# EAGLE design Red Build Button v1.1 (EAGLE 6.1)
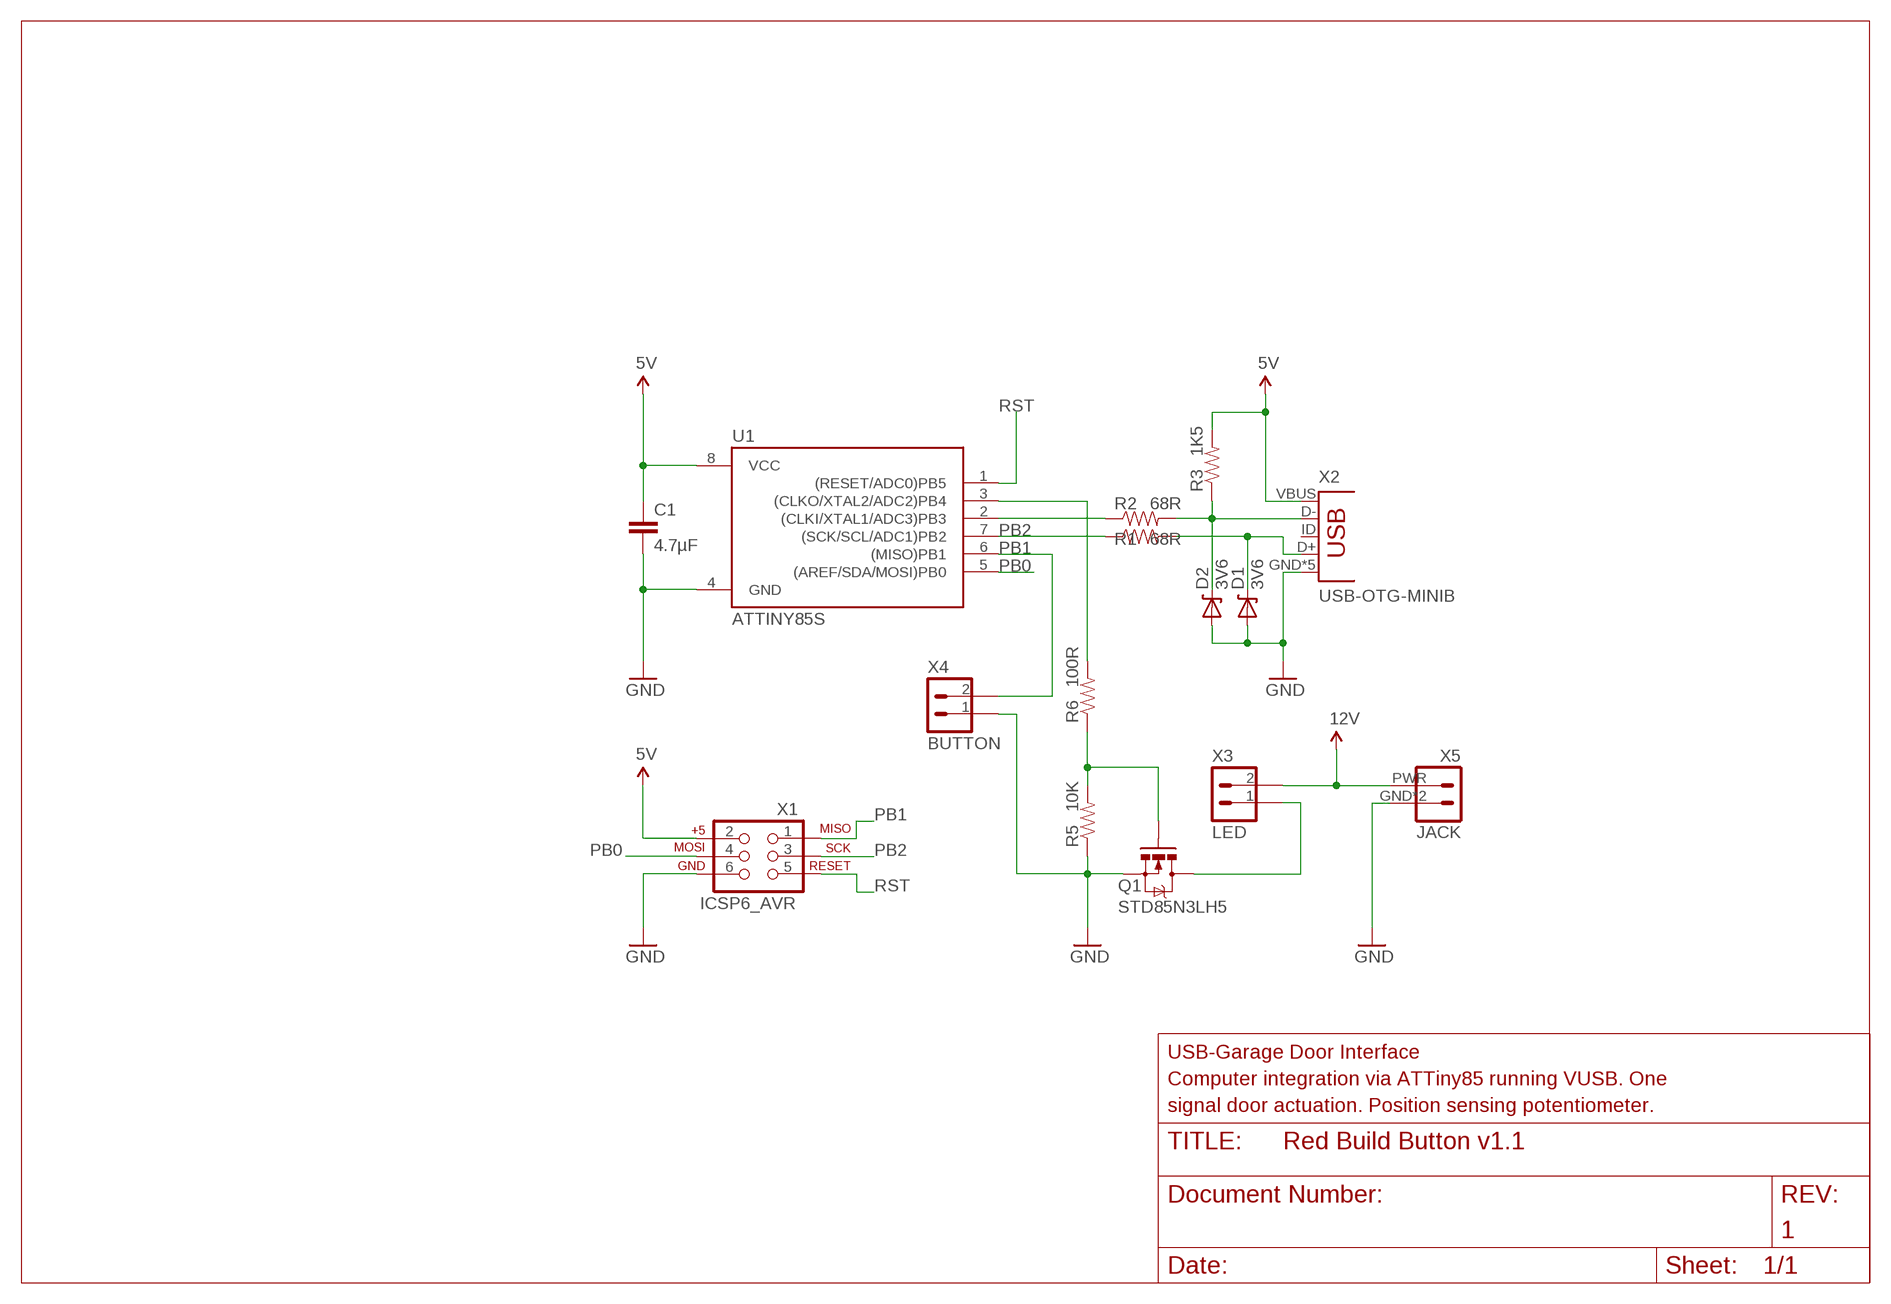
[diagram p0: schematic, sheet 1]
FRAME1 (DINA4_L): DESC1: USB-Garage Door Interface; DESC2: Computer integration via ATTiny85 running VUSB. One; DESC3: signal door actuation. Position sensing potentiometer.; REV: 1

## Parts
C1  4.7µF  CAP0603  [0603-CAP]
D1  3V6  DIODE-ZENERSOD323  [SOD323]
D2  3V6  DIODE-ZENERSOD323  [SOD323]
Q1  STD85N3LH5  MOSFET-NCH-DPAK  [DPAK]
R1  68R  RESISTOR0603-RES  [0603-RES]
R2  68R  RESISTOR0603-RES  [0603-RES]
R3  1K5  RESISTOR0603-RES  [0603-RES]
R5  10K  RESISTOR0603-RES  [0603-RES]
R6  100R  RESISTOR0603-RES  [0603-RES]
U1  ATTINY85S  [SOIC8-EIAJ]
X1  ICSP6_AVR  [2X3]
X2  USB-OTG-MINIB  [USB-MINIB-S-SMD]
X3  LED  PWR-SOCKETJST-XA-RTH  [JST-XA-S02B]
X4  BUTTON  PWR-SOCKETJST-PA-RTH  [JST-PA-S02B]
X5  JACK  PWR-SOCKETJACK  [PWR-JACK_PTH]

## Nets
5V: C1.1 R3.2 U1.8(VCC) X1.2(5V) X2.VBUS
12V: X3.2(+) X5.PWR(+)
D+: D1.C R1.2 X2.D+
D-: D2.C R2.2 R3.1 X2.D-
GATE: Q1.1(G) R5.2 R6.1
GND: C1.2 D1.A D2.A Q1.3(S) R5.1 U1.4(GND) X1.6(GND) X2.GND X2.GND@2(GND) X2.GND@3(GND) X2.GND@4(GND) X2.GND@5(GND) X4.1(-) X5.GND(-) X5.GND@2(-)
LED-: Q1.4(D) X3.1(-)
PB0: U1.5((AREF/SDA/MOSI)PB0) X1.4(MOSI)
PB1: U1.6((MISO)PB1) X1.1(MISO) X4.2(+)
PB2: R1.1 U1.7((SCK/SCL/ADC1)PB2) X1.3(SCK)
PB3: R2.1 U1.2((CLKI/XTAL1/ADC3)PB3)
PB4: R6.2 U1.3((CLKO/XTAL2/ADC2)PB4)
RST: U1.1((RESET/ADC0)PB5) X1.5(RESET)
Unconnected: X2.ID

## Library data of the parts
C1 = Jan:CAP: Capacitor Standard, non-polarised capacitors such as ceramics.
D1 D2 = Jan:DIODE-ZENER: Zener Diode Zener voltage regulator diodes.
Q1 = Jan:MOSFET-NCH: Generic N-Channel MOSFET
R1-R3 R5 R6 = SparkFun-Passives:RESISTOR: Resistor Basic schematic elements and footprints for 0603, 1206, and PTH resistors.
U1 = Jan:ATTINY85: Atmel ATtiny85 Microcontroller 8-bit AVR Microcontroller with 8K Bytes In-System Programmable Flash 8 Kbytes FLASH 512 bytes SRAM 512 bytes EEPROM 6 programmable IO lines 4-channel 10-bit ADC 2x 8-bit timer/counters (1x high speed)
X1 = Jan:ICSP6_AVR: 6 Pin ICSP for AVR µC In Circuit Serial Programming header for working with Atmel AVR microcontrollers. Compact, 6-pin interface rather than the larger 10-pin version.
X2 = Jan:USB-OTG: USB Connector 5th pin (ID) for micro connectors
X3-X5 = Jan:PWR-SOCKET: Power Socket Polarised 2-pin socket for power transfer/etc.

## Board
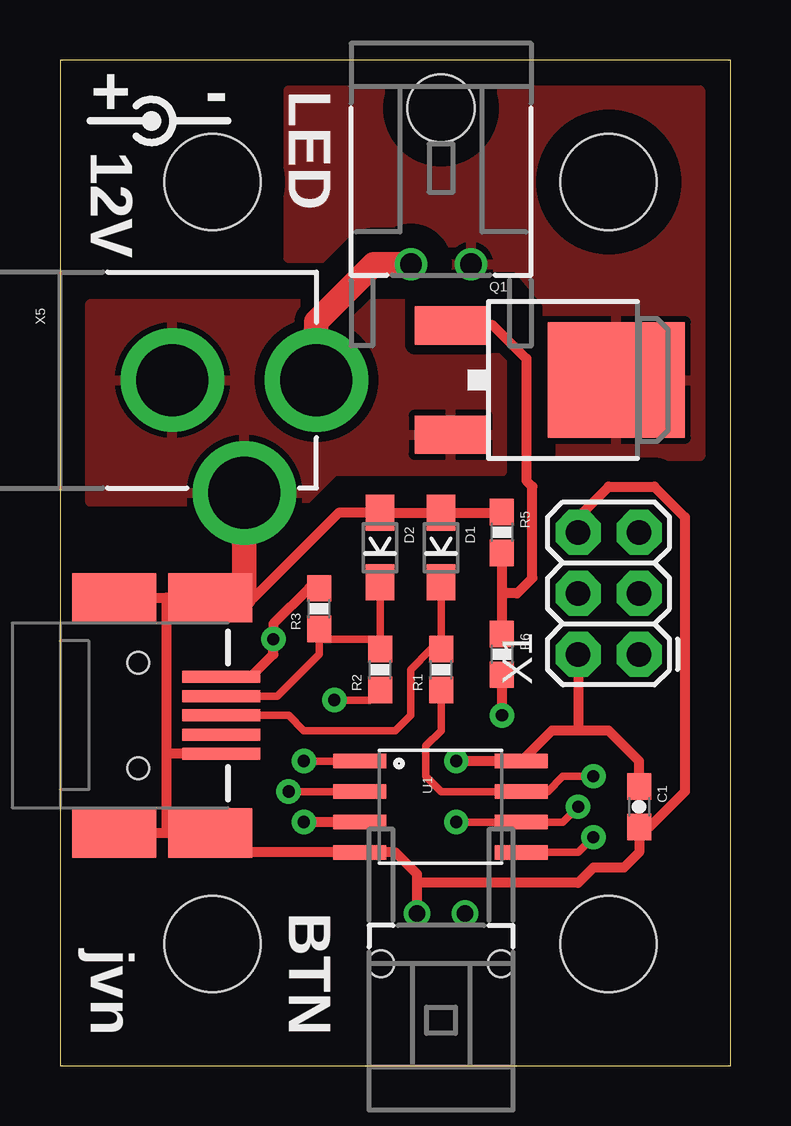
[diagram p1: board, top side]
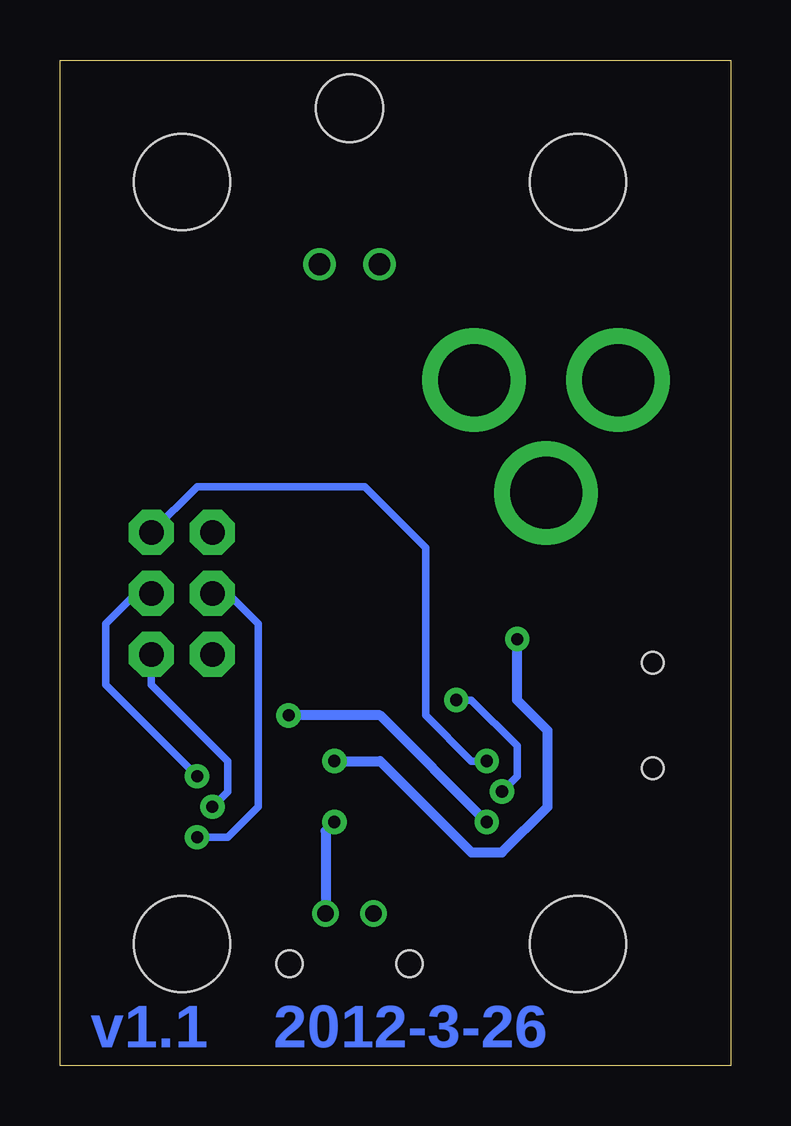
[diagram p2: board, bottom side, seen from below]

Size 27.94 x 41.91 mm. Coordinates in mm from the lower left corner, seen from the top.
Outline: 0,0 27.94,0 27.94,41.91 0,41.91 0,0
Copper layers (1*16): Top 0.035mm / dielectric 1.5mm / Bottom 0.035mm
Design rules: minimum track width 8mil, minimum drill 20mil, track to track 8mil, track to pad 8mil, pad to pad 8mil, via to via 8mil, smd to smd 8mil, copper to edge 10mil, drill to drill 8mil, minimum pad ring 8mil, minimum via ring 10mil, stop-mask expansion 3mil, vias tented up to drill 20mil, thermal gap 10mil
Holes 4 mm at 6.35,36.83 22.86,36.83 6.35,5.08 22.86,5.08

### Footprints (pad centres in the part's own frame; a part is rotated, then mirrored left to right if it is on the bottom)
0603-CAP = smd 1.1 x 1: 1 -0.85,0; 2 0.85,0
SOD323 = smd 1.5 x 1.2: A -1.45,0; C 1.45,0
DPAK = smd 1.6 x 3: 1 -2.28,-5.31; 3 2.28,-5.31 | smd 4.826 x 5.715: 4 0,1.588
0603-RES = smd 1.1 x 1: 1 -0.85,0; 2 0.85,0
SOIC8-EIAJ = smd 0.61 x 2.21: 1 -1.905,-3.378; 2 -0.635,-3.378; 3 0.635,-3.378; 4 1.905,-3.378; 5 1.905,3.353; 6 0.635,3.353; 7 -0.635,3.353; 8 -1.905,3.353
2X3 = drill 1.016 pad 1.88 octagon: 1 0,0; 2 0,2.54; 3 2.54,0; 4 2.54,2.54; 5 5.08,0; 6 5.08,2.54
USB-MINIB-S-SMD = smd 3.25 x 0.5: D+ 0.375,0; D- 0.375,0.8; GND 0.375,-1.6; ID 0.375,-0.8; VBUS 0.375,1.6 | smd 3.5 x 2.05: GND@2 -0.1,4.9; GND@3 -0.1,-4.9; GND@4 -4.1,4.9; GND@5 -4.1,-4.9 | hole 0.9: -3.1,2.2; -3.1,-2.2
JST-XA-S02B = drill 0.9: 1 -1.25,0; 2 1.25,0 | hole 2.8: 0,-6.5
JST-PA-S02B = drill 0.7: 1 1,0; 2 -1,0 | hole 1.1: -2.5,2.1; 2.5,2.1
PWR-JACK_PTH = drill 2.997 pad 4.318: GND 0,-2.3; GND@2 4.7,0.7; PWR 0,3.7

### Placement (x,y rotation side)
C1  24.13,10.79 270 top
D1  15.88,21.59 270 top
D2  13.34,21.59 270 top
Q1  21.59,28.57 270 top
R1  15.88,16.51 90 top
R2  13.34,16.51 90 top
R3  10.79,19.05 90 top
R5  18.41,22.23 270 top
R6  18.41,17.14 270 top
U1  15.88,10.79 270 top
U$1  [CENTRE+]  3.81,39.37 0 top
X1  24.13,17.14 90 top
X2  6.35,14.61 0 top
X3  15.88,33.4 180 top
X4  15.88,6.35 180 top
X5  6.99,28.57 270 top

### Tracks (layer width: path | path; a pad name or v marks a point on that pad's centre or on a via)
5V  (via drill 0.51)
  Top 0.406: C1.1 24.13,12.7 22.86,13.97 21.59,13.97 | 21.59,13.97 20.5,13.97 U1.8 v16.51,12.7 | X1.2 21.59,13.97 | X2.VBUS 7.95,16.2 8.89,17.14 v8.89,17.78 8.89,18.41 10.38,19.9 R3.2
  Bottom 0.406: v16.51,12.7 14.61,12.7 10.79,8.89 9.53,8.89 7.62,10.79 7.62,13.97 8.89,15.24 v8.89,17.78
12V
  Top 1.016: X5.PWR 10.69,31 13.08,33.4 X3.2
D+
  Top 0.305: D1.C R1.2 15.46,17.36 14.61,16.51 14.61,14.61 13.97,13.97 10.16,13.97 9.53,14.61 X2.D+
D-
  Top 0.305: X2.D- 9.05,15.4 10.79,17.14 10.79,17.78 | D2.C R2.2 13.34,17.78 10.79,17.78 | 10.79,17.78 R3.1
GATE
  Top 0.406: R5.2 18.41,19.68 | 18.41,19.68 R6.1 | 18.41,19.68 19.05,19.68 19.68,20.32 19.68,24.13 19.43,24.38 19.43,29.46 18.04,30.86 Q1.1
GND
  Top 0.406: U1.4 12.7,8.89 | U1.4 6.25,8.89 X2.GND@3 | X2.GND@5 X2.GND@3 | X2.GND@4 4.45,19.5 | 4.45,19.5 X2.GND@2 8.07,19.5 11.61,23.04 D2.A D1.A 18.41,23.04 R5.1 | X2.GND@3 4.45,9.71 4.45,13.01 | 4.45,13.01 4.45,19.5 | X2.GND 4.45,13.01 | X1.6 21.59,22.86 22.86,24.13 24.77,24.13 26.04,22.86 26.04,11.43 24.55,9.95 C1.2 24.13,8.89 23.5,8.26 22.23,8.26 21.59,7.62 14.88,7.62 | X4.1 14.88,7.62 | 14.88,7.62 14.88,7.99 13.97,8.89 U1.4
  Top 1.016: X5.GND@2 7.68,19.5 X2.GND@2
  pour Top (isolate 0.406): 18.41,24.77 11.43,24.77 10.16,23.5 1.27,23.5 1.27,31.75 18.41,31.75
LED-
  pour Top (isolate 1.016): 20.32,25.4 20.32,31.75 19.05,33.27 16.26,33.27 15.88,33.66 9.53,33.66 9.53,40.64 26.67,40.64 26.67,25.4
PB0  (via drill 0.51)
  Top 0.305: U1.5 21.59,8.89 v22.23,9.53
  Bottom 0.305: X1.4 20.95,19.68 19.68,18.41 19.68,10.79 20.95,9.53 v22.23,9.53
PB1  (via drill 0.51)
  Top 0.305: v21.59,10.79 20.95,10.16 U1.6 v16.51,10.16
  Bottom 0.305: v21.59,10.79 20.95,11.43 20.95,12.7 24.13,15.88 X1.1
  Bottom 0.406: v16.51,10.16 16.88,9.79 X4.2
PB2  (via drill 0.51)
  Top 0.305: v22.23,12.06 20.95,12.06 20.32,11.43 U1.7 15.88,11.43 15.24,12.06 15.24,13.34 15.88,13.97 R1.1
  Bottom 0.305: X1.3 24.77,19.68 26.04,18.41 26.04,15.88 v22.23,12.06
PB3  (via drill 0.51)
  Top 0.305: R2.1 12.91,15.24 v11.43,15.24 | U1.2 v9.53,11.43
  Bottom 0.305: v9.53,11.43 8.89,12.06 8.89,13.34 10.79,15.24 v11.43,15.24
PB4  (via drill 0.51)
  Top 0.406: R6.2 v18.41,14.61 | U1.3 v10.16,10.16
  Bottom 0.406: v10.16,10.16 14.61,14.61 v18.41,14.61
RST  (via drill 0.51)
  Top 0.305: U1.1 v10.16,12.7
  Bottom 0.305: X1.5 22.23,24.13 15.24,24.13 12.7,21.59 12.7,14.61 10.79,12.7 v10.16,12.7

### Text on the board
Bottom: 2012-3-26 | v1.1
tPlace: LED | 12V | jvn | BTN